# EasyEDA Pro project water-meter-v1.eprj, schematic Schematic1
Create Date: 2024-06-17; Page Name: P1; Project Name: water-meter-v1; Schematic Name: Schematic1; Update Date: 2024-07-02; Drawn: Edwin Mwiti; Page Size: A4; Part Number: JLCPCB-002; Version: V0.1
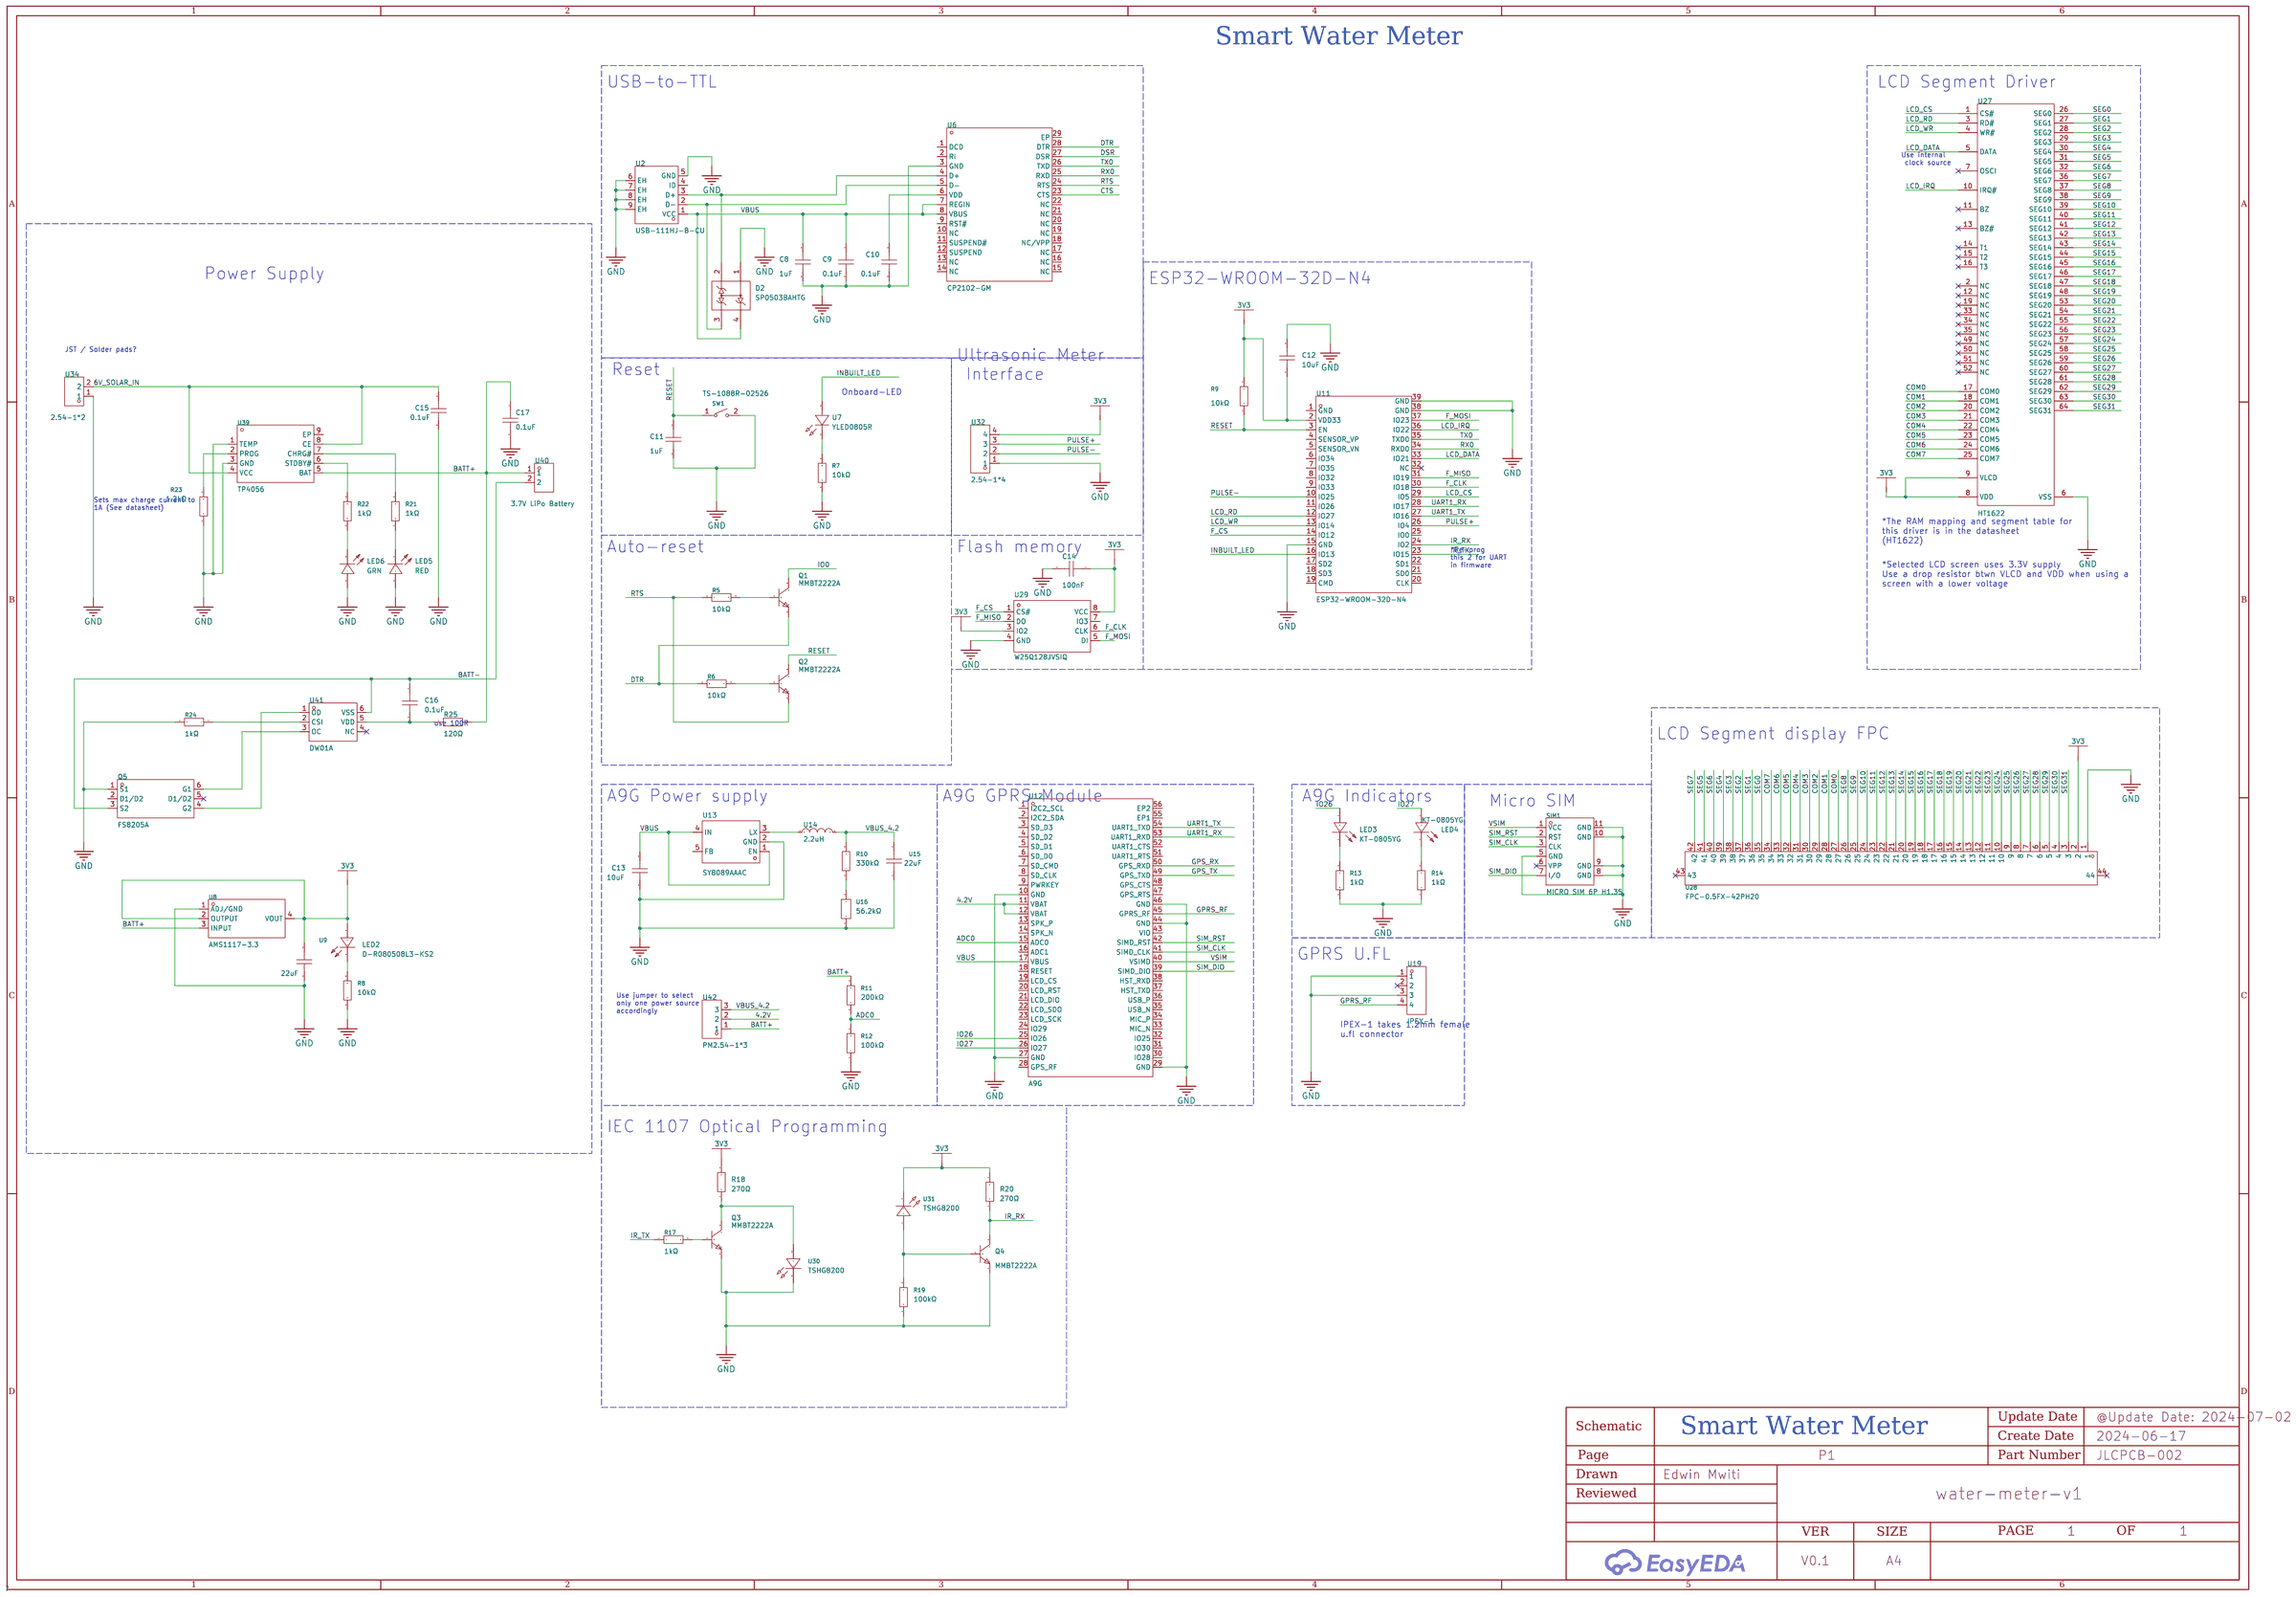
[diagram p0: schematic sheet]

## Parts
C8  1uF  [C0805]
C9  0.1uF  [C0805]
C10  0.1uF  [C0805]
C11  1uF  [C0805]
C12  10uF  [C0805]
C13  10uF  [C0805]
C14  100nF  [C0805]
C15  0.1uF  [C0805]
C16  0.1uF  [C0805]
C17  0.1uF  [C0805]
D2  SP0503BAHTG  [SOT-143-4_L2.9-W1.3-P1.92-LS2.4-BL]
LED2  D-R080508L3-KS2  [LED0805-RD]
LED3  KT-0805YG  [LED0805-R-RD]
LED4  KT-0805YG  [LED0805-R-RD]
LED5  RED  [LED0805-RD]
LED6  GRN  [LED0805-R-RD_GREEN]
Q1  MMBT2222A  [SOT-23-3_L2.9-W1.3-P1.90-LS2.4-BR]
Q2  MMBT2222A  [SOT-23-3_L2.9-W1.3-P1.90-LS2.4-BR]
Q3  MMBT2222A  [SOT-23-3_L2.9-W1.3-P1.90-LS2.4-BR]
Q4  MMBT2222A  [SOT-23-3_L2.9-W1.3-P1.90-LS2.4-BR]
Q5  FS8205A  [SOT-23-6_L2.9-W1.6-P0.95-LS2.8-BR]
R5  10kΩ  [R0805]
R6  10kΩ  [R0805]
R7  10kΩ  [R0805]
R8  10kΩ  [R0805]
R9  10kΩ  [R0805]
R10  330kΩ  [R0805]
R11  200kΩ  [R0805]
R12  100kΩ  [R0805]
R13  1kΩ  [R0805]
R14  1kΩ  [R0805]
R17  1kΩ  [R0805]
R18  270Ω  [R0805]
R19  100kΩ  [R0805]
R20  270Ω  [R0805]
R21  1kΩ  [R0805]
R22  1kΩ  [R0805]
R23  1.2kΩ  [R0805]
R24  1kΩ  [R0805]
R25  120Ω  [R0805]
SIM1  MICRO SIM 6P H1.35  [SIM-SMD_MICRO-SIM-6P-H1.35]
SW1  TS-1088R-02526  [SW-SMD_L3.9-W3.0-P4.45]
U2  USB-111HJ-B-CU  [MICRO-USB-SMD_HOOYA_USB-111HJ-B-CU]
U6  CP2102-GM  [QFN-28_L5.0-W5.0-P0.50-TL-EP3.2]
U7  YLED0805R  [LED0805-RD]
U8  AMS1117-3.3  [SOT-223-3_L6.5-W3.4-P2.30-LS7.0-BR]
U9  22uF  [C0805]
U11  ESP32-WROOM-32D-N4  [WIFIM-SMD_39P-L25.5-W18.0-P1.27-BL]
U12  A9G  [GSM-SMD_A9-GSM-GPRSMODULE]
U13  SY8089AAAC  [SOT-23-5_L3.0-W1.7-P0.95-LS2.8-BR]
U14  2.2uH  [IND-SMD_L4.5-W4.0_SLF0403-1]
U15  22uF  [C0805]
U16  56.2kΩ  [R0805]
U19  IPEX-1  [IPEX-SMD_4P-L2.6-W2.6-LS3.0]
U27  HT1622  [LQFP-64_L7.0-W7.0-P0.40-LS9.2-BL]
U28  FPC-0.5FX-42PH20  [FPC-SMD_42P-P0.50_YUANDI_FPC-0.5FX-42PH20]
U29  W25Q128JVSIQ  [SOIC-8_L5.3-W5.3-P1.27-LS8.0-BL]
U30  TSHG8200  [LED-TH_BD5.0-P2.54-FD-1]
U31  TSHG8200  [LED-TH_BD5.0-P2.54-FD-1]
U32  2.54-1*4  [HDR-TH_4P-P2.54-V-M-1]
U34  2.54-1*2  [HDR-TH_2P-P2.54-V-M]
U39  TP4056  [ESOP-8_L4.9-W3.9-P1.27-LS6.0-BL-EP]
U40  3.7V LiPo Battery  [HDR-TH_2P-P2.54-V-M]
U41  DW01A  [SOT-23-6_L2.9-W1.6-P0.95-LS2.8-BL]
U42  PM2.54-1*3  [HDR-TH_3P-P2.54-V-F]

## Library data of the parts
C8-C11 C15-C17 = CAP_0805: Supplier Footprint: 0805
C12 C13 = C0805X6S106K250NT: Capacitance: Voltage Rated: Temperature Coefficient:; LCSC Part Name: 10uF 25V; Supplier Part: C2835551; Manufacturer: SANYEAR(叁叶源); Supplier Footprint: 0805; JLCPCB Part Class: Extended Part; Datasheet: https://atta.szlcsc.com/upload/public/pdf/source/20211010/C2835566_14A0738C7D65B521DA1087F759FD87A4.pdf; Supplier: LCSC
C14 = MBK0805X7R104K500NT: Capacitance: Voltage Rated: Temperature Coefficient:; LCSC Part Name: 100nF 50V; Supplier Part: C2830721; Manufacturer: FH-BK(风华邦科); Supplier Footprint: 0805; JLCPCB Part Class: Extended Part; Datasheet: https://atta.szlcsc.com/upload/public/pdf/source/20210427/C2830703_E1E3E2CFFA21ECBD84F9CFD2C7D2B314.pdf; Supplier: LCSC
D2 = SP0503BAHTG_C3040626: Type:ESD; Supplier Part: C3040626; Manufacturer: TECH PUBLIC(台舟); Supplier Footprint: SOT-143; JLCPCB Part Class: Extended Part; Datasheet: https://atta.szlcsc.com/upload/public/pdf/source/20220624/AF311198C26773668D549EDE18553982.pdf; Supplier: LCSC; Type: ESD
LED2 LED5 = D-R080508L3-KS2: Emitted Color:Red; Supplier Part: C130114; Manufacturer: ARKLED(方舟); Supplier Footprint: 0805; JLCPCB Part Class: Extended Part; Datasheet: https://atta.szlcsc.com/upload/public/pdf/source/20170919/C130114_1505787182379976884.pdf; Supplier: LCSC; Emitted Color: Red
LED3 LED4 = KT-0805YG: Emitted Color:Green-yellow; LCSC Part Name: 0805 黄绿 普绿; Supplier Part: C2292; Manufacturer: KENTO; Supplier Footprint: 0805; JLCPCB Part Class: Extended Part; Datasheet: https://atta.szlcsc.com/upload/public/pdf/source/20161024/1477287943397.pdf; Supplier: LCSC; Emitted Color: Green-yellow
LED6 = SZYY0805YG: Emitted Color:Green-yellow; LCSC Part Name: 普绿/黄绿; Supplier Part: C434435; Manufacturer: yongyu(永裕光电); Supplier Footprint: 0805; JLCPCB Part Class: Extended Part; Datasheet: https://atta.szlcsc.com/upload/public/pdf/source/20191204/C434435_1187404D4D35A500174CD35CE47973D5.pdf; Supplier: LCSC; Emitted Color: Green-yellow
Q1-Q4 = MMBT2222A_C2688232: Transistor Type: Collector Current (Ic): Collector-Emitter Breakdown Voltage (Vceo): Power Dissipation (Pd): DC Current Gain (hFE@Ic,Vce):100@150mA,10V DC Current Gain (hFE@Ic,Vce):100@150mA,10V Transition Frequency (fT):300MHz Collector Cut-Off Current (; LCSC Part Name: NPN 电流:600mA 耐压:40V; Supplier Part: C2688232; Manufacturer: WPMtek(维攀); Supplier Footprint: SOT-23; JLCPCB Part Class: Extended Part; Datasheet: https://atta.szlcsc.com/upload/public/pdf/source/20210222/C2688232_1427C38ED2DAC6A2887023259A4BCD10.pdf; Supplier: LCSC; DC Current Gain (hFE@Ic,Vce): 100@150mA,10V; Transition Frequency (fT): 300MHz; Collector Cut-Off Current (Icbo): 10nA; Collector-Emitter Saturation Voltage (VCE(sat)@Ic,Ib): 300mV@150mA,15mA
Q5 = FS8205A_C908265: Type:2 N-Channel Drain Source Voltage (Vdss): Continuous Drain Current (Id): Power Dissipation (Pd): Drain Source On Resistance (RDS(on)@Vgs,Id):18mΩ@4.5V,6A Gate Threshold Voltage (Vgs(th)@Id):1.2V@250uA Total Gate Charge (Qg@Vgs):11nC@4.5V Input Capacit; LCSC Part Name: 2个N沟道 耐压:20V 电流:6A; Supplier Part: C908265; Manufacturer: FUXINSEMI(富芯森美); Supplier Footprint: SOT-23-6L; JLCPCB Part Class: Extended Part; Datasheet: https://atta.szlcsc.com/upload/public/pdf/source/20201027/C908265_C6F1A5E0FB14735EF799FEF607A99450.pdf; Supplier: LCSC; Type: 2 N-Channel; Drain Source On Resistance (RDS(on)@Vgs,Id): 18mΩ@4.5V,6A; Gate Threshold Voltage (Vgs(th)@Id): 1.2V@250uA; Total Gate Charge (Qg@Vgs): 11nC@4.5V; Input Capacitance (Ciss@Vds): 800pF@8V; Reverse Transfer Capacitance (Crss@Vds): 125pF@8V; Operating Temperature: -55℃~+150℃@(Tj)
R5-R9 = RMC080510K1%N: Resistance: Tolerance:±1% Tolerance:±1% Power(Watts):; LCSC Part Name: 10kΩ ±1% 125mW; Supplier Part: C269742; Manufacturer: Tyohm(幸亚电阻); Supplier Footprint: 0805; JLCPCB Part Class: Extended Part; Datasheet: https://atta.szlcsc.com/upload/public/pdf/source/20190115/C325956_D27151D492FFB3C9AB4A6F14FE01F30A.pdf; Supplier: LCSC; Tolerance: ±1%
R10 = RMC0805330K5%N: Resistance: Tolerance:±5% Tolerance:±5% Power(Watts):; LCSC Part Name: 330kΩ ±5% 125mW; Supplier Part: C269556; Manufacturer: Tyohm(幸亚电阻); Supplier Footprint: 0805; JLCPCB Part Class: Extended Part; Datasheet: https://atta.szlcsc.com/upload/public/pdf/source/20190115/C325956_D27151D492FFB3C9AB4A6F14FE01F30A.pdf; Supplier: LCSC; Tolerance: ±5%
R11 = RMC0805200K1%N: Resistance: Tolerance:±1% Tolerance:±1% Power(Watts):; LCSC Part Name: 200kΩ ±1% 125mW; Supplier Part: C325770; Manufacturer: Tyohm(幸亚电阻); Supplier Footprint: 0805; JLCPCB Part Class: Extended Part; Datasheet: https://atta.szlcsc.com/upload/public/pdf/source/20190115/C325956_D27151D492FFB3C9AB4A6F14FE01F30A.pdf; Supplier: LCSC; Tolerance: ±1%
R12 R19 = RMC0805100K1%N: Resistance: Tolerance:±1% Tolerance:±1% Power(Watts):; LCSC Part Name: 100kΩ ±1% 125mW; Supplier Part: C269740; Manufacturer: Tyohm(幸亚电阻); Supplier Footprint: 0805; JLCPCB Part Class: Extended Part; Datasheet: https://atta.szlcsc.com/upload/public/pdf/source/20190115/C325956_D27151D492FFB3C9AB4A6F14FE01F30A.pdf; Supplier: LCSC; Tolerance: ±1%
R13 R14 = RMC08051K1%N: Resistance: Tolerance:±1% Tolerance:±1% Power(Watts):; LCSC Part Name: 1kΩ ±1% 125mW; Supplier Part: C269744; Manufacturer: Tyohm(幸亚电阻); Supplier Footprint: 0805; JLCPCB Part Class: Extended Part; Datasheet: https://atta.szlcsc.com/upload/public/pdf/source/20190115/C325956_D27151D492FFB3C9AB4A6F14FE01F30A.pdf; Supplier: LCSC; Tolerance: ±1%
R17 R21 R22 R24 = RMC08051K5%N: Resistance: Tolerance:±5% Tolerance:±5% Power(Watts):; LCSC Part Name: 1kΩ ±5% 125mW; Supplier Part: C269727; Manufacturer: Tyohm(幸亚电阻); Supplier Footprint: 0805; JLCPCB Part Class: Extended Part; Datasheet: https://atta.szlcsc.com/upload/public/pdf/source/20190115/C325956_D27151D492FFB3C9AB4A6F14FE01F30A.pdf; Supplier: LCSC; Tolerance: ±5%
R18 R20 = RC0805JR-07270RL: Type:Thick Film Resistors Resistance: Tolerance:±5% Tolerance:±5% Power(Watts): Overload Voltage (Max): Temperature Coefficient:±100ppm/℃ Temperature Coefficient:±100ppm/℃ Operating Temperature Range:-55℃~+155℃ Operating Temperature Range:-55℃~+155℃; LCSC Part Name: 厚膜电阻 270Ω ±5% 125mW; Supplier Part: C93657; Manufacturer: YAGEO(国巨); Supplier Footprint: 0805; JLCPCB Part Class: Extended Part; Datasheet: https://atta.szlcsc.com/upload/public/pdf/source/20180821/C275644_0D56F95EFF785E7D9A1FEF436B37DA78.pdf; Supplier: LCSC; Type: Thick Film Resistors; Tolerance: ±5%; Temperature Coefficient: ±100ppm/℃; Operating Temperature Range: -55℃~+155℃
R23 = RMC08051.2K5%N: Resistance: Tolerance:±5% Tolerance:±5% Power(Watts):; LCSC Part Name: 1.2kΩ ±5% 125mW; Supplier Part: C269381; Manufacturer: Tyohm(幸亚电阻); Supplier Footprint: 0805; JLCPCB Part Class: Extended Part; Datasheet: https://atta.szlcsc.com/upload/public/pdf/source/20190115/C325956_D27151D492FFB3C9AB4A6F14FE01F30A.pdf; Supplier: LCSC; Tolerance: ±5%
R25 = RMC 0805 120R J N: Resistance: Tolerance:±5% Tolerance:±5% Power(Watts):; LCSC Part Name: 120Ω ±5% 125mW; Supplier Part: C269726; Manufacturer: Tyohm(幸亚电阻); Supplier Footprint: 0805; JLCPCB Part Class: Extended Part; Datasheet: https://atta.szlcsc.com/upload/public/pdf/source/20190115/C325956_D27151D492FFB3C9AB4A6F14FE01F30A.pdf; Supplier: LCSC; Tolerance: ±5%
SIM1 = MICRO SIM 6P H1.35: Card Connection Mode:Self bomb Card Type:MicroSIM卡 Connector Type:Deck Body Height (Max):1.35mm Contact Material:Copper Alloy Contact Plating:Gold Operating Temperature Range:-40℃~+70℃ Operating Temperature Range:-40℃~+70℃; LCSC Part Name: 自弹式 MicroSIM卡 卡座; Supplier Part: C7529380; Manufacturer: SHOU HAN(首韩); Supplier Footprint: SMD; JLCPCB Part Class: Extended Part; Datasheet: https://atta.szlcsc.com/upload/public/pdf/source/20230818/E7BEF2B67F13BC032D113DA99F81A025.pdf; Supplier: LCSC; Card Connection Mode: Self bomb; Card Type: MicroSIM卡; Connector Type: Deck; Body Height (Max): 1.35mm; Contact Material: Copper Alloy; Contact Plating: Gold; Operating Temperature Range: -40℃~+70℃
SW1 = TS-1088R-02526: Circuit:SPST Actuator Style:Round Button Mounting Style:Brick nogging Switch Length:3.9mm Switch Width:2.93mm Switch Height:2.5mm Contact Current:50mA Voltage Rating (DC):12V With Lamp:- Mechanical Life:-; LCSC Part Name: 3.9*2.93*2.5mm 立贴 轻触开关; Supplier Part: C455281; Manufacturer: XUNPU(讯普); Supplier Footprint: SMD,3x4mm; JLCPCB Part Class: Extended Part; Datasheet: https://atta.szlcsc.com/upload/public/pdf/source/20191118/C455281_EC5379764BC1462550DF64BBBFEA9579.pdf; Supplier: LCSC; Circuit: SPST; Actuator Style: Round Button; Mounting Style: Brick nogging; Switch Length: 3.9mm; Switch Width: 2.93mm; Switch Height: 2.5mm; Contact Current: 50mA; Voltage Rating (DC): 12V
U2 = USB-111HJ-B-CU: Number of Contacts:5P; Supplier Part: C19712370; Manufacturer: HOOYA(皓宇电子); Supplier Footprint: SMD; Datasheet: https://atta.szlcsc.com/upload/public/pdf/source/20231222/A6F13E0F491DBE2F7014157678E3AF70.pdf; Supplier: LCSC; Number of Contacts: 5P
U6 = CP2102-GM: Applications Function:USB转UART Protocol:UART Supply Voltage:3V~3.6V Supply Voltage:3V~3.6V Operating Temperature:-40℃~+85℃ Operating Temperature:-40℃~+85℃; LCSC Part Name: Silicon Labs-MCU; Supplier Part: C430012; Manufacturer: SKYWORKS/SILICON LABS(芯科); Supplier Footprint: QFN-28-EP(5x5); JLCPCB Part Class: Extended Part; Datasheet: https://atta.szlcsc.com/upload/public/pdf/source/20190920/C430014_98A01585C07E39A29412843282533F6F.pdf; Supplier: LCSC; Applications Function: USB转UART; Protocol: UART; Supply Voltage: 3V~3.6V; Operating Temperature: -40℃~+85℃
U7 = YLED0805R: Emitted Color:Red Forward Voltage (VF):1.8V~2.4V Forward Voltage (VF):1.8V~2.4V Power Dissipation:60mW Forward Current:20mA Dominant Wavelength:615nm~630nm Dominant Wavelength:615nm~630nm Peak Wavelength:645nm Diode Configuration:- Lens Color:- Color Temp; Supplier Part: C19171391; Manufacturer: YONGYUTAI(永裕泰); Supplier Footprint: 0805; JLCPCB Part Class: Extended Part; Datasheet: https://atta.szlcsc.com/upload/public/pdf/source/20231027/AB486D22E6D71BC59190C48A798367E6.pdf; Supplier: LCSC; Emitted Color: Red; Forward Voltage (VF): 1.8V~2.4V; Power Dissipation: 60mW; Forward Current: 20mA; Dominant Wavelength: 615nm~630nm; Peak Wavelength: 645nm; Operating Temperature: -40℃~+85℃
U8 = AMS1117-3.3_C18212698: Supplier Part: C18212698; Manufacturer: TECH PUBLIC(台舟); Supplier Footprint: SOT-223; Datasheet: https://atta.szlcsc.com/upload/public/pdf/source/20231024/2F46361C191D0B74404CBB3E85314756.pdf; Supplier: LCSC
U9 U15 = V226M0805X5R100NHP: Capacitance: Voltage Rated: Temperature Coefficient:; LCSC Part Name: 22uF 10V; Supplier Part: C4749141; Manufacturer: VIIYONG(微容); Supplier Footprint: 0805; JLCPCB Part Class: Extended Part; Datasheet: https://atta.szlcsc.com/upload/public/pdf/source/20220726/368A884C4BEE94B298FF72509AD4C15A.pdf; Supplier: LCSC
U11 = ESP32-WROOM-32D-N4: LCSC Part Name: 通用型Wi-Fi+BT+BLE MCU模组; Supplier Part: C473012; Manufacturer: ESPRESSIF(乐鑫); Supplier Footprint: SMD,18x25.5mm; JLCPCB Part Class: Extended Part; Datasheet: https://atta.szlcsc.com/upload/public/pdf/source/20191225/C473012_1E74417EE995DBCF17C94BD318A37DAB.pdf; Supplier: LCSC
U12 = A9G: Communication System:GPRS Interface Type:SDMMC；ADC；I2C；UART；USB；GPIO Communication Frequency:900MHz；1800MHz；850MHz；1900MHz Supply Voltage:3.8V~4.2V Supply Voltage:3.8V~4.2V Current Consumption:2mA; LCSC Part Name: 完整的四频 GSM/GPRS 模块 停产; Supplier Part: C133738; Manufacturer: Ai-Thinker(安信可); Supplier Footprint: SMD,18.8x19.2mm; JLCPCB Part Class: Extended Part; Datasheet: https://atta.szlcsc.com/upload/public/pdf/source/20200407/C503601_70B2CCE4A266F5F8CBD525D2B26B3DFC.pdf; Supplier: LCSC; Communication System: GPRS; Interface Type: SDMMC；ADC；I2C；UART；USB；GPIO; Communication Frequency: 900MHz；1800MHz；850MHz；1900MHz; Supply Voltage: 3.8V~4.2V; Current Consumption: 2mA
U13 = SY8089AAAC: Function:Step-down type Input Voltage:- Input Voltage:- Output Current (Max):- Switching Frequency:- Synchronous Rectification:- Number of Outputs:- Topology:- Switch tube (built-in/external):内置; Supplier Part: C78988; Manufacturer: silergy(矽力杰); Supplier Footprint: SOT-23-5; JLCPCB Part Class: Extended Part; Datasheet: https://atta.szlcsc.com/upload/public/pdf/source/20210826/394049C81A2AF57A190C26FDBC282657.pdf; Supplier: LCSC; Function: Step-down type; Switch tube (built-in/external): 内置
U14 = CY43-2.2UH: Inductance: Tolerance:±20% Tolerance:±20% Rated Current: Saturation Current (Isat):- DC Resistance (DCR): Q @ Freq:- Frequency - Self Resonant:- Ratings:; LCSC Part Name: 2.2uH ±20%; Supplier Part: C2929416; Manufacturer: SHOU HAN(首韩); Supplier Footprint: SMD,4.5x4mm; JLCPCB Part Class: Extended Part; Datasheet: https://atta.szlcsc.com/upload/public/pdf/source/20211213/02D0D236E4480B75E64C77ABE9E913B4.pdf; Supplier: LCSC; Tolerance: ±20%
U16 = SCR0805F56K2: Type:Thick Film Resistors Resistance: Tolerance:±1% Tolerance:±1% Power(Watts): Overload Voltage (Max): Operating Temperature Range:-55℃~+155℃ Operating Temperature Range:-55℃~+155℃; LCSC Part Name: 厚膜电阻 56.2kΩ ±1% 125mW; Supplier Part: C3016759; Manufacturer: VO(翔胜); Supplier Footprint: 0805; JLCPCB Part Class: Extended Part; Datasheet: https://atta.szlcsc.com/upload/public/pdf/source/20220513/247AF9639BA21CF93567DC289CCC6A22.pdf; Supplier: LCSC; Type: Thick Film Resistors; Tolerance: ±1%; Operating Temperature Range: -55℃~+155℃
U19 = IPEX-1: RF Series:IPEX; LCSC Part Name: IPEX; Supplier Part: C2987682; Manufacturer: Ziisor(致哲); Supplier Footprint: SMD; JLCPCB Part Class: Extended Part; Datasheet: https://atta.szlcsc.com/upload/public/pdf/source/20220330/F8401AC17D19E8F359D8A0802C3350C4.pdf; Supplier: LCSC; RF Series: IPEX
U27 = HT1622_C46302: Supplier Part: C46302; Manufacturer: HOLTEK(合泰/盛群); Supplier Footprint: LQFP-64(7x7); JLCPCB Part Class: Extended Part; Supplier: LCSC
U28 = FPC-0.5FX-42PH20: Locking Feature:Clamshell Contact Type:Bottom Contact Number of Contacts:42P Pitch:0.5mm; LCSC Part Name: 间距:0.5mm P数:42P 翻盖式 下接; Supplier Part: C19077736; Manufacturer: Yuandi(元迪); Supplier Footprint: SMD,P=0.5mm; Datasheet: https://atta.szlcsc.com/upload/public/pdf/source/20231020/8C5C9672F58830B43E158EFA81131209.pdf; Supplier: LCSC; Locking Feature: Clamshell; Contact Type: Bottom Contact; Number of Contacts: 42P; Pitch: 0.5mm
U29 = W25Q128JVSIQ: Interface Type:- Memory Size:128Mbit Clock Frequency (fc):- Supply Voltage:- Supply Voltage:- Supply Current (Read):- Supply Current (Program):- Supply Current (Erase):- Standby supply current:- Page Programming Time (Tpp):- Block Erase Time (tBE):- Data; LCSC Part Name: W25Q128JVSIQ 编带; Supplier Part: C97521; Manufacturer: WINBOND(华邦); Supplier Footprint: SOIC-8-208mil; JLCPCB Part Class: Basic Part; Datasheet: https://atta.szlcsc.com/upload/public/pdf/source/20170316/1489627409956.pdf; Supplier: LCSC; Memory Size: 128Mbit
U30 U31 = TSHG8200: Vf - Forward Voltage:1.5V Vf - Forward Voltage:1.5V Wavelength:830nm Wavelength:830nm Radiant Intensity:120mW/sr@100mA View Angle:20° Operating Temperature:-40℃~+85℃ Operating Temperature:-40℃~+85℃; Supplier Part: C6722952; Manufacturer: VISHAY(威世); Supplier Footprint: 插件; JLCPCB Part Class: Extended Part; Datasheet: https://atta.szlcsc.com/upload/public/pdf/source/20231218/5FE536AB1FBC871B68DA88BC1085D3BF.pdf; Supplier: LCSC; Vf - Forward Voltage: 1.5V; Wavelength: 830nm; Radiant Intensity: 120mW/sr@100mA; View Angle: 20°; Operating Temperature: -40℃~+85℃
U32 = 2.54-1*4: Pin Structure:1x4P Pitch:2.54mm Number of Rows:Plugin Number of Pins:4P; Supplier Part: C5116483; Manufacturer: ZHOURI(洲日); Supplier Footprint: 插件,P=2.54mm; JLCPCB Part Class: Extended Part; Datasheet: https://atta.szlcsc.com/upload/public/pdf/source/20220729/BC3442D33C9CDBB7F5DC20B12A8605A8.pdf; Supplier: LCSC; Pin Structure: 1x4P; Pitch: 2.54mm; Number of Rows: Plugin; Number of Pins: 4P
U34 U40 = 2.54-1*2: Pin Structure:1x2P Pitch:2.54mm Number of Rows:Plugin Number of Pins:2P Contact Plating:Gold; LCSC Part Name: 停产; Supplier Part: C5116481; Manufacturer: ZHOURI(洲日); Supplier Footprint: 插件,P=2.54mm; JLCPCB Part Class: Extended Part; Datasheet: https://atta.szlcsc.com/upload/public/pdf/source/20220729/DF18AADA08AA3A4F1D3B0508BB8F7248.pdf; Supplier: LCSC; Pin Structure: 1x2P; Pitch: 2.54mm; Number of Rows: Plugin; Number of Pins: 2P; Contact Plating: Gold
U39 = TP4056_C382139: LCSC Part Name: 1A锂电池充电IC; Supplier Part: C382139; Manufacturer: TPOWER(天源); Supplier Footprint: ESOP-8; JLCPCB Part Class: Extended Part; Datasheet: https://atta.szlcsc.com/upload/public/pdf/source/20190327/C382139_EC85960E6FE3E26856C240C81751A184.pdf; Supplier: LCSC
U41 = DW01A_C2927799: The Chip Type:电池保护芯片 Supply Voltage:-300mV~8V Supply Voltage:-300mV~8V Maximum Charge Current:- Charging Saturation Voltage:- End-Off Voltage:- Type of Battery:锂离子/Polymer Number of Cells:1 Number of Cells:1 Operating Temperature:-40℃~+85℃ Operating Tempe; Supplier Part: C2927799; Manufacturer: YONGYUTAI(永裕泰); Supplier Footprint: SOT-23-6; JLCPCB Part Class: Extended Part; Datasheet: https://atta.szlcsc.com/upload/public/pdf/source/20211207/8DC9CB9A742765EFB66910D35511359F.pdf; Supplier: LCSC; The Chip Type: 电池保护芯片; Supply Voltage: -300mV~8V; Type of Battery: 锂离子/Polymer; Number of Cells: 1; Operating Temperature: -40℃~+85℃
U42 = PM2.54-1*3: Holes Structure:1x3P Pitch:2.54mm Row Spacing:2.54mm Circular Hole / Square Hole:方孔 Mounting Type:Straight Number of Rows:Plugin Number of Holes:3P Current Rating (Max):2.5A Holes Direction:Top Insulation Height:8.5mm Operating Temperature Range:-40℃~+105; LCSC Part Name: 间距:2.54mm 1x3P 直插; Supplier Part: C5116529; Manufacturer: ZHOURI(洲日); Supplier Footprint: 插件,P=2.54mm; JLCPCB Part Class: Extended Part; Datasheet: https://atta.szlcsc.com/upload/public/pdf/source/20220729/0B9CDCB2053AD78CED9CDFEF888323E9.pdf; Supplier: LCSC; Holes Structure: 1x3P; Pitch: 2.54mm; Row Spacing: 2.54mm; Circular Hole / Square Hole: 方孔; Mounting Type: Straight; Number of Rows: Plugin; Number of Holes: 3P; Current Rating (Max): 2.5A; Holes Direction: Top; Insulation Height: 8.5mm; Operating Temperature Range: -40℃~+105℃

## Nets
3V3: C12.1 C14.1 LED2.2(A) R9.2 R18.2 R20.2 U8.2(OUTPUT) U8.4(VOUT) U9.2 U11.2(VDD33) U27.8(VDD) U27.9(VLCD) U28.2 U29.3(IO2) U29.8(VCC) U31.2(C) U32.4
4.2V: U12.11(VBAT) U12.12(VBAT) U42.2
6V_SOLAR_IN: C15.1 U34.2 U39.4(VCC) U39.8(CE)
GND: C8.2 C9.2 C10.2 C11.2 C12.2 C13.1 C14.2 C15.2 C17.2 D2.1 LED5.2(A) LED6.1(+) Q3.2(E) Q4.2(E) Q5.1(S1) R7.1 R8.1 R12.1 R13.1 R14.1 R19.1 R23.1 R24.2 SIM1.5(GND) SIM1.8(GND) SIM1.9(GND) SIM1.10(GND) SIM1.11(GND) SW1.2 U2.5(GND) U2.6(EH) U2.7(EH) U2.8(EH) U2.9(EH) U6.3(GND) U8.1(ADJ/GND) U9.1 U11.15(GND) U11.38(GND) U11.39(GND) U12.10(GND) U12.27(GND) U12.29(GND) U12.44(GND) U12.46(GND) U13.2(GND) U15.1 U16.1 U19.1 U19.3 U27.6(VSS) U28.1 U29.4(GND) U30.2(C) U32.1 U34.1 U39.1(TEMP) U39.3(GND)
VBUS: C8.1 C9.1 C13.2 D2.4 U2.1(VCC) U6.7(REGIN) U6.8(VBUS) U12.17(VBUS) U13.1(EN) U13.4(IN)
VBUS_4.2: R10.2 U14.2 U15.2 U42.3
ADC0: R11.1 R12.2 U12.15(ADC0)
BATT+: C17.1 R11.2 R25.2 U8.3(INPUT) U39.5(BAT) U40.1 U42.1
BATT-: C16.1 Q5.3(S2) U40.2 U41.6(VSS)
COM0: U27.17(COM0) U28.27
COM1: U27.18(COM1) U28.28
COM2: U27.20(COM2) U28.29
COM3: U27.21(COM3) U28.30
COM4: U27.22(COM4) U28.31
COM5: U27.23(COM5) U28.32
COM6: U27.24(COM6) U28.33
COM7: U27.25(COM7) U28.34
CTS: U6.23(CTS)
DSR: U6.27(DSR)
DTR: Q1.2(E) R6.1 U6.28(DTR)
F_CLK: U11.30(IO18) U29.6(CLK)
F_CS: U11.14(IO12) U29.1(CS#)
F_MISO: U11.31(IO19) U29.2(DO)
F_MOSI: U11.37(IO23) U29.5(DI)
GPRS_RF: U12.45(GPRS_RF) U19.4
GPS_RX: U12.50(GPS_RXD)
GPS_TX: U12.49(GPS_TXD)
INBUILT_LED: U7.2(A) U11.16(IO13)
IO0: Q1.3(C)
IO26: LED3.1(A) U12.25(IO26)
IO27: LED4.1(A) U12.26(IO27)
IR_RX: Q4.3(C) R20.1 U11.24(IO2)
IR_TX: R17.1 U11.23(IO15)
LCD_CS: U11.29(IO5) U27.1(CS#)
LCD_DATA: U11.33(IO21) U27.5(DATA)
LCD_IRQ: U11.36(IO22) U27.10(IRQ#)
LCD_RD: U11.12(IO27) U27.3(RD#)
LCD_WR: U11.13(IO14) U27.4(WR#)
PULSE+: U11.26(IO4) U32.3
PULSE-: U11.10(IO25) U32.2
RESET: C11.1 Q2.3(C) R9.1 SW1.1 U11.3(EN)
RTS: Q2.2(E) R5.1 U6.24(RTS)
RX0: U6.25(RXD) U11.34(RXD0)
SEG0: U27.26(SEG0) U28.35
SEG1: U27.27(SEG1) U28.36
SEG2: U27.28(SEG2) U28.37
SEG3: U27.29(SEG3) U28.38
SEG4: U27.30(SEG4) U28.39
SEG5: U27.31(SEG5) U28.41
SEG6: U27.32(SEG6) U28.40
SEG7: U27.36(SEG7) U28.42
SEG8: U27.37(SEG8) U28.26
SEG9: U27.38(SEG9) U28.25
SEG10: U27.39(SEG10) U28.24
SEG11: U27.40(SEG11) U28.23
SEG12: U27.41(SEG12) U28.22
SEG13: U27.42(SEG13) U28.21
SEG14: U27.43(SEG14) U28.20
SEG15: U27.44(SEG15) U28.19
SEG16: U27.45(SEG16) U28.18
SEG17: U27.46(SEG17) U28.17
SEG18: U27.47(SEG18) U28.16
SEG19: U27.48(SEG19) U28.15
SEG20: U27.53(SEG20) U28.14
SEG21: U27.54(SEG21) U28.13
SEG22: U27.55(SEG22) U28.12
SEG23: U27.56(SEG23) U28.11
SEG24: U27.57(SEG24) U28.10
SEG25: U27.58(SEG25) U28.9
SEG26: U27.59(SEG26) U28.8
SEG27: U27.60(SEG27) U28.7
SEG28: U27.61(SEG28) U28.6
SEG29: U27.62(SEG29) U28.5
SEG30: U27.63(SEG30) U28.4
SEG31: U27.64(SEG31) U28.3
SIM_CLK: SIM1.3(CLK) U12.41(SIMD_CLK)
SIM_DIO: SIM1.7(I/O) U12.39(SIMD_DIO)
SIM_RST: SIM1.2(RST) U12.42(SIMD_RST)
TX0: U6.26(TXD) U11.35(TXD0)
UART1_RX: U11.28(IO17) U12.53(UART1_RXD)
UART1_TX: U11.27(IO16) U12.54(UART1_TXD)
VSIM: SIM1.1(VCC) U12.40(VSIMD)
$1N3425: C10.1 U6.6(VDD)
$1N3562: D2.2 U2.3(D+) U6.4(D+)
$1N3573: D2.3 U2.2(D-) U6.5(D-)
$1N4092: Q1.1(B) R5.2
$1N4095: Q2.1(B) R6.2
$1N4302: R7.2 U7.1(K)
$1N6426: U13.3(LX) U14.1
$1N6765: R10.1 U16.2
$1N8518: LED3.2(K) R13.2
$1N8521: LED4.2(K) R14.2
$1N17733: Q3.1(B) R17.2
$1N17781: Q3.3(C) R18.1 U30.1(A)
$1N18025: Q4.1(B) R19.2 U31.1(A)
$1N20787: R21.2 U39.7(CHRG#)
$1N20791: LED5.1(K) R21.1
$1N20889: LED6.2(-) R22.1
$1N20892: R22.2 U39.6(STDBY#)
$1N20989: R23.2 U39.2(PROG)
$1N21679: Q5.4(G2) U41.1(OD)
$1N21690: Q5.6(G1) U41.3(OC)
$1N21695: R24.1 U41.2(CSI)
$1N21874: C16.2 R25.1 U41.5(VDD)
$1N22185: LED2.1(K) R8.2

Not connected (* = marked no-connect by the designer): Q5 2(D1/D2) 5(D1/D2)*; SIM1 6(VPP)*; U2 4(ID); U6 1(DCD) 2(RI) 9(RST#) 10(NC) 11(SUSPEND#) 12(SUSPEND) 13(NC) 14(NC) 15(NC) 16(NC) 17(NC) 18(NC/VPP) 19(NC) 20(NC) 21(NC) 22(NC) 29(EP); U11 1(GND) 4(SENSOR_VP) 5(SENSOR_VN) 6(IO34) 7(IO35) 8(IO32) 9(IO33) 11(IO26) 17(SD2) 18(SD3) 19(CMD) 20(CLK) 21(SD0) 22(SD1) 25(IO0) 32(NC)*; U12 1(I2C2_SCL) 2(I2C2_SDA) 3(SD_D3) 4(SD_D2) 5(SD_D1) 6(SD_D0) 7(SD_CMD) 8(SD_CLK) 9(PWRKEY) 13(SPK_P) 14(SPK_N) 16(ADC1) 18(RESET) 19(LCD_CS) 20(LCD_RST) 21(LCD_DIO) 22(LCD_SDO) 23(LCD_SCK) 24(IO29) 28(GPS_RF) 30(IO28) 31(IO30) 32(IO25) 33(MIC_N) 34(MIC_P) 35(USB_N) 36(USB_P) 37(HST_TXD) 38(HST_RXD) 43(VIO) 47(GPS_RTS) 48(GPS_CTS) 51(UART1_RTS) 52(UART1_CTS) 55(EP1) 56(EP2); U13 5(FB); U19 2*; U27 2(NC)* 7(OSCI)* 11(BZ)* 12(NC)* 13(BZ#)* 14(T1)* 15(T2)* 16(T3)* 19(NC)* 33(NC)* 34(NC)* 35(NC)* 49(NC)* 50(NC)* 51(NC)* 52(NC)*; U28 43* 44*; U29 7(IO3); U39 9(EP); U41 4(NC)*

## Notes on the sheet
- Smart Water Meter
- USB-to-TTL
- LCD Segment Driver
- Use internal
   clock source
- Power Supply
- ESP32-WROOM-32D-N4
- JST / Solder pads?
- Reset
- Ultrasonic Meter
   Interface
- Onboard-LED
- Sets max charge current to
  1A (See datasheet)
- *The RAM mapping and segment table for
  this driver is in the datasheet
  (HT1622)
- Auto-reset
- Flash memory
- *Re-prog
  this 2 for UART
  in firmware
- *Selected LCD screen uses 3.3V supply
  Use a drop resistor btwn VLCD and VDD when using a
  screen with a lower voltage
- use 100R
- LCD Segment display FPC
- A9G Power supply
- A9G GPRS Module
- A9G Indicators
- Micro SIM
- GPRS U.FL
- Use jumper to select
  only one power source
  accordingly
- IPEX-1 takes 1.2mm female
  u.fl connector
- IEC 1107 Optical Programming
- Smart Water Meter
